# Altium schematic sheet rev02_3.SchDoc
size 409 x 282 mm
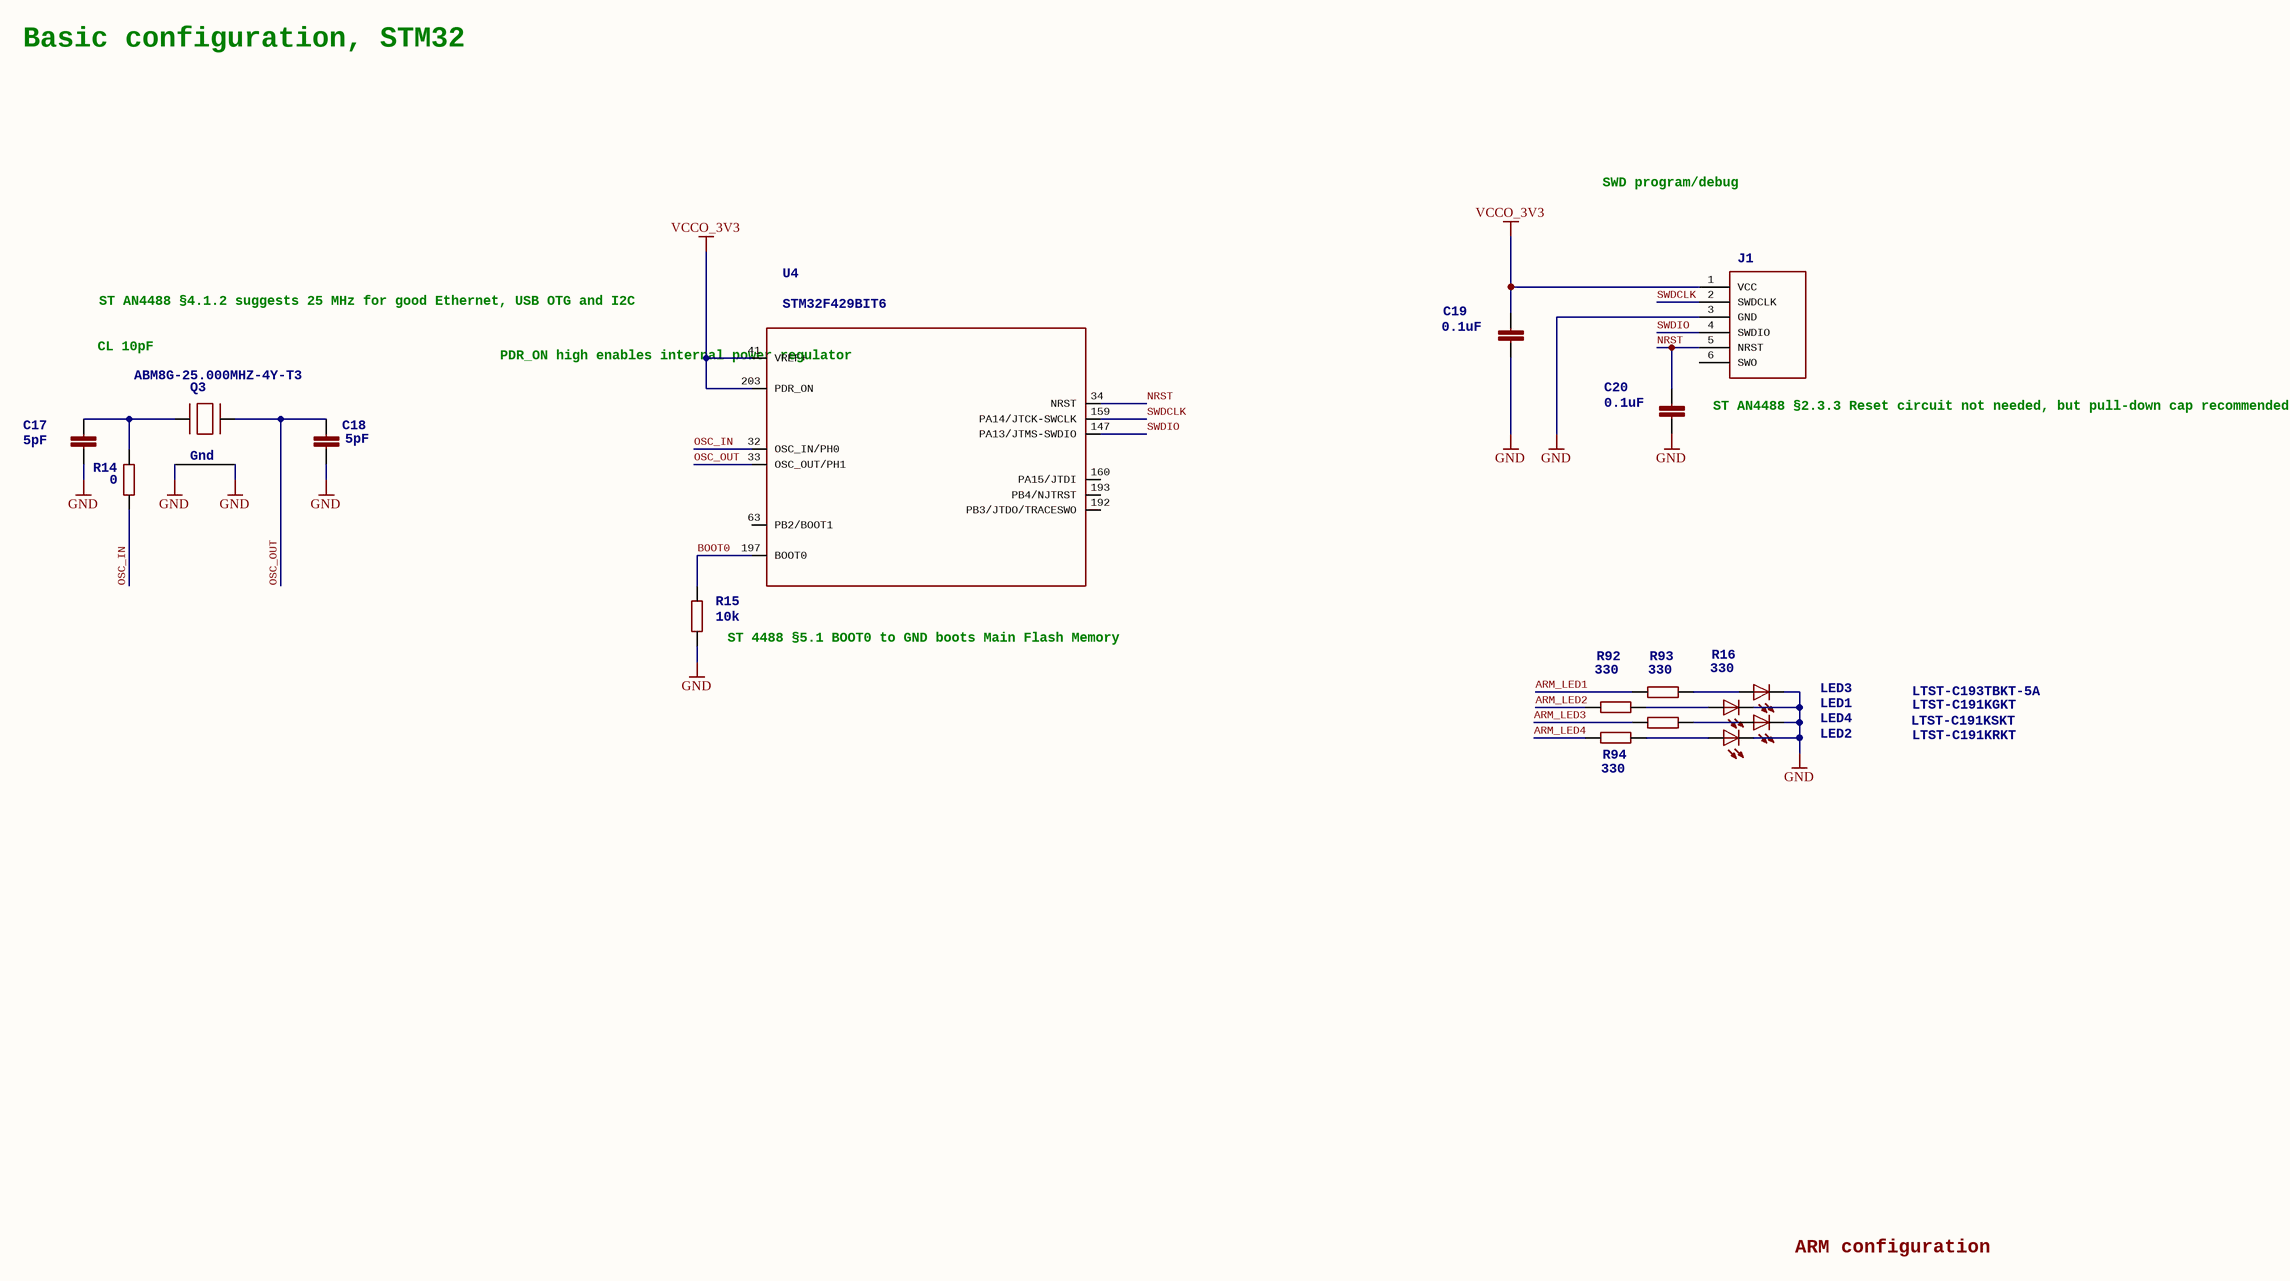
[diagram p0: rev02_3.SchDoc]

## Parts
C17  value 5pF  [C_0402]
C18  value 5pF  [C_0402]
C19  value 0.1uF  [C_0402]
C20  value 0.1uF  [C_0402]
J1  STM32-SWD  [PLS-6]  (value not drawn)
LED1  LTST-C191KGKT  [VD_0603]
LED2  LTST-C191KRKT  [VD_0603]
LED3  LTST-C193TBKT-5A  [VD_0603]
LED4  LTST-C191KSKT  [VD_0603]
Q3  ABM8G-25.000MHZ-4Y-T3  >NAME: Q3  [CRYSTAL_3.2X2.5]
R14  value 0  >NAME: R14  [R_0402]
R15  value 10k  >NAME: R15  [R_0402]
R16  value 330  [R_0402]
R92  value 330  [R_0402]
R93  value 330  [R_0402]
R94  value 330  [R_0402]
U4  >NAME: U4  (hidden comment: STM32F429BIT6)  (part B of 4)

## Nets
GND: C17.1 C18.1 C19.2 C20.2 J1.3(GND) LED1.2(C) LED2.2(C) LED3.2(C) LED4.2(C) Q3.2(G2) Q3.4(G1) R15.1
VCCO_3V3: C19.1 J1.1(VCC) U4.41(VREF+) U4.203(PDR_ON)
ARM_LED1: R93.2
ARM_LED2: R92.2
ARM_LED3: R16.2
ARM_LED4: R94.2
BOOT0: R15.2 U4.197(BOOT0)
NRST: C20.1 J1.5(NRST) U4.34(NRST)
OSC_IN: R14.1 U4.32(OSC_IN/PH0)
OSC_OUT: C18.2 Q3.3(X2) U4.33(OSC_OUT/PH1)
SWDCLK: J1.2(SWDCLK) U4.159(PA14/JTCK-SWCLK)
SWDIO: J1.4(SWDIO) U4.147(PA13/JTMS-SWDIO)
NetC17_2: C17.2 Q3.1(X1) R14.2
NetLED1_1: LED1.1(A) R92.1
NetLED2_1: LED2.1(A) R94.1
NetLED3_1: LED3.1(A) R93.1
NetLED4_1: LED4.1(A) R16.1

Not connected (* = marked no-connect by the designer): J1 6(SWO); U4 63(PB2/BOOT1) 160(PA15/JTDI) 192(PB3/JTDO/TRACESWO) 193(PB4/NJTRST)

## Notes on the sheet
- Basic configuration, STM32
- SWD program/debug
- ST AN4488 §4.1.2
  suggests 25 MHz for good
  Ethernet, USB OTG and I2C
- CL 10pF
- (near U4) PDR_ON high enables
  internal power regulator
- ST AN4488 §2.3.3
  Reset circuit not needed,
  but pull-down cap
  recommended.
- (near R15) ST 4488 §5.1
  BOOT0 to GND boots
  Main Flash Memory
- ARM configuration

## Library data of the parts
C17-C20 = C-EUC0402: 0402 CAPACITOR
J1 = STM32-SWD: STM32 SWD connector
LED1 = LEDCHIP-LED0603: GREEN LED
LED2 = LEDCHIP-LED0603: RED LED
LED3 = LEDCHIP-LED0603: BLUE LED
LED4 = LEDCHIP-LED0603: YELLOW LED
Q3 = XTAL-4-3225: Abracon 25MHz 10pF 4-pin 3.2 x 2.5mm crystal; MPN: ABM8G-25.000MHZ-4Y-T3; OC_FARNELL: 2467848; >VALUE: XTAL-4-3225; Gnd: Gnd
R14-R16 R92-R94 = R-EU_R0402: 0402 Resistor 5%
  R15: TOLERANCE: 5%
U4 = STM32F429BIT6: STM32F429 Cortex-M4 CPU / 180 MHz, 256 KB RAM, 2 MB Flash; OC_FARNELL: 2469581; >VALUE: STM32F429BIT6